# EAGLE schematic brick_i2c_compass_LSM303DLH (EAGLE 7.3.0)
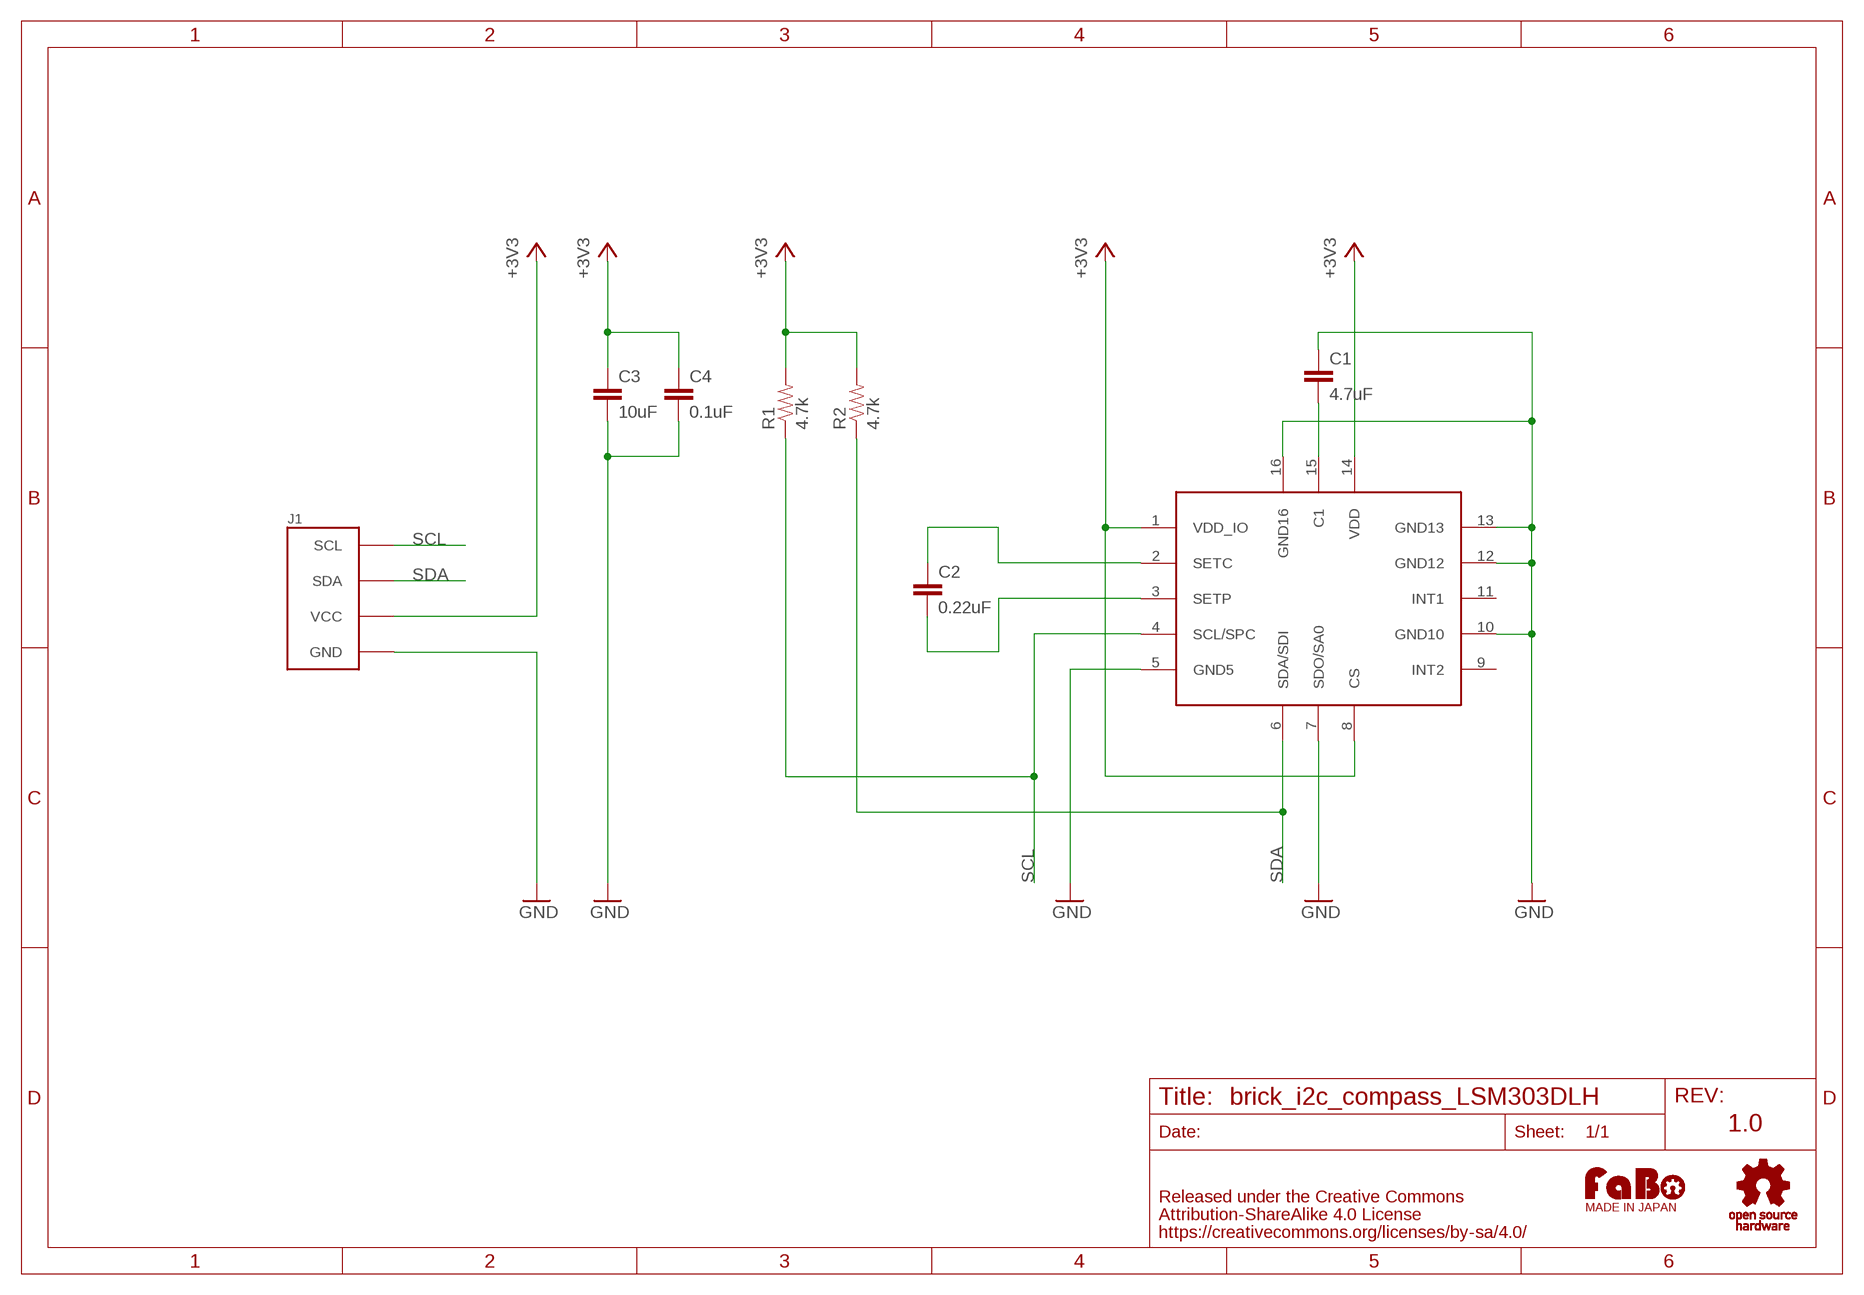
[diagram p0: schematic, sheet 1]

## Parts
C1  4.7uF  CAP-EIA0603  [EIA0603]
C2  0.22uF  CAP-EIA0603  [EIA0603]
C3  10uF  CAP-EIA0603  [EIA0603]
C4  0.1uF  CAP-EIA0603  [EIA0603]
J1  BRICK_I2C  [BRICK_I2C]
R1  4.7k  RES-EIA0603  [EIA0603]
R2  4.7k  RES-EIA0603  [EIA0603]
U$2  ST-LSM303DLH  [ST-LSM303DLH]
U$4  LOGO_OSHW_T-M  [LOGO_OSHW_T_M]
U$5  LOGO_FABO-M  [LOGO_FABO_M]

## Nets
+3V3: C3.1 C4.1 J1.VCC R1.2 R2.2 U$2.1(VDD_IO) U$2.8(CS) U$2.14(VDD)
GND: C1.1 C3.2 C4.2 J1.GND U$2.5(GND5) U$2.7(SDO/SA0) U$2.10(GND10) U$2.12(GND12) U$2.13(GND13) U$2.16(GND16)
N$1: C2.1 U$2.2(SETC)
N$2: C2.2 U$2.3(SETP)
N$3: C1.2 U$2.15(C1)
SCL: J1.SCL R1.1 U$2.4(SCL/SPC)
SDA: J1.SDA R2.1 U$2.6(SDA/SDI)
Unconnected: U$2.9(INT2) U$2.11(INT1)

## Notes on the sheet
- 1.0

## Library data of the parts
C1-C4 = gclue:CAP: Capacitor Standard 0603 ceramic capacitor
J1 = gclue:BRICK_I2C: FaBo Brick 4pin(I2C)
R1 R2 = gclue:RES
U$2 = GClue-Mems:ST-LSM303DLH
U$4 = gclue:LOGO_OSHW_T
U$5 = FaBo:LOGO_FABO